# Altium schematic sheet Otto 2.SchDoc
size B
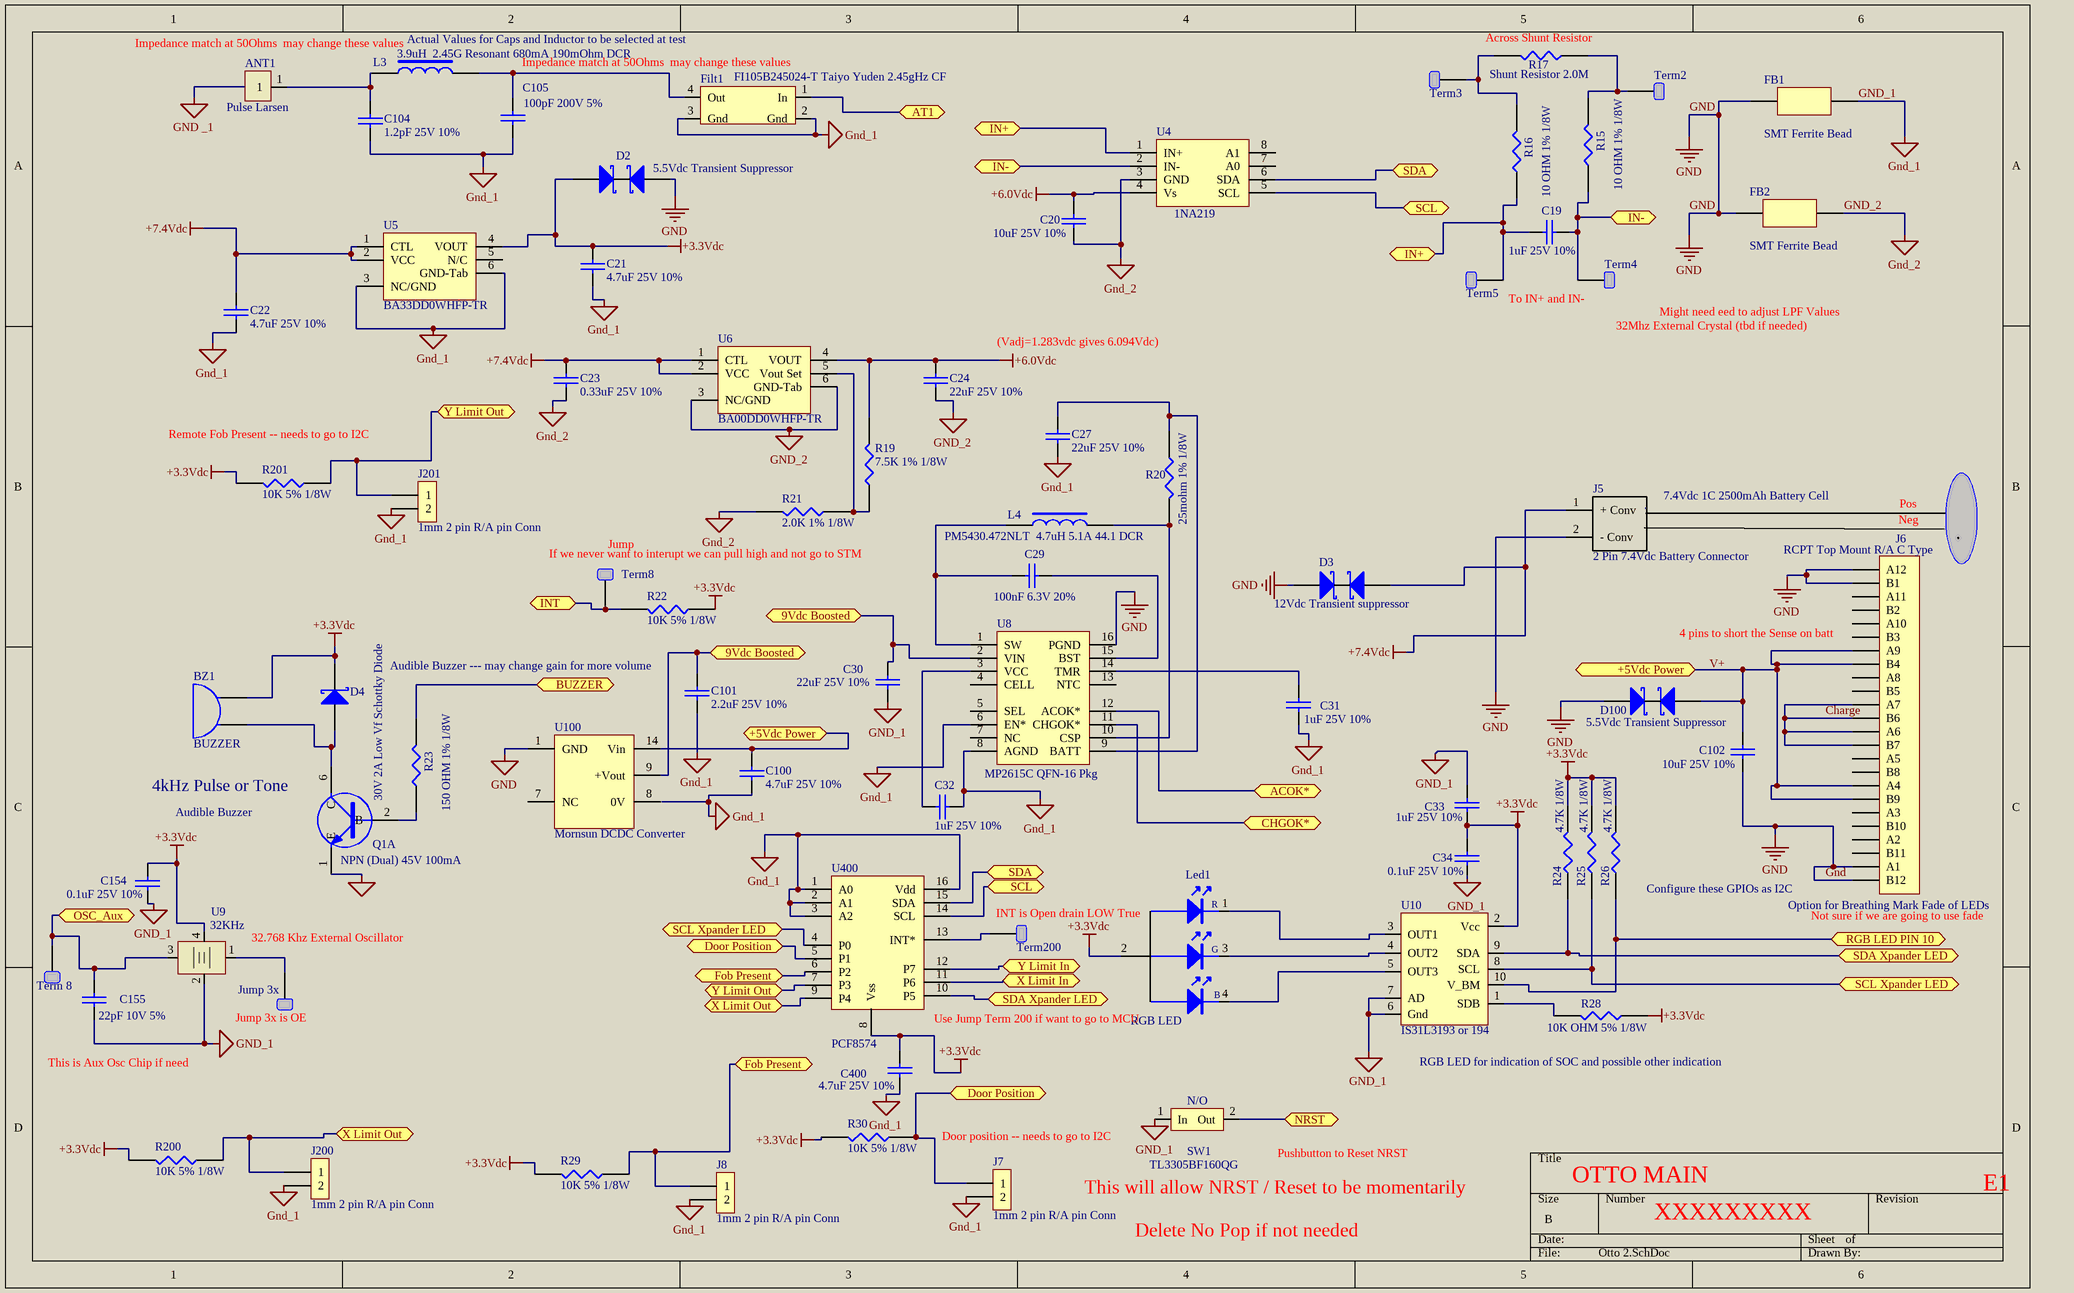
[diagram p0: Otto 2.SchDoc]

## Parts
ANT1  Pulse Larsen  [Pulse Larsen - duplicate]
BZ1  BUZZER  [BUZZER-smd]
C19  1uF 25V 10%  [0603]
C20  10uF 25V 10%  [BEADC3225X280N]
C21  4.7uF 25V 10%  [0603]
C22  4.7uF 25V 10%  [0603]
C23  0.33uF 25V 10%  [0603]
C24  22uF 25V 10%  [C1210]
C27  22uF 25V 10%  [C1210]
C29  100nF 6.3V 20%  [0603]
C30  22uF 25V 10%  [C1210]
C31  1uF 25V 10%  [0603]
C32  1uF 25V 10%  [0603]
C33  1uF 25V 10%  [0603]
C34  0.1uF 25V 10%  [0402]
C100  4.7uF 25V 10%  [0603]
C101  2.2uF 25V 10%  [0603]
C102  10uF 25V 10%  [BEADC3225X280N]
C104  1.2pF 25V 10%  [0402]
C105  100pF 200V 5%  [0603]
C154  0.1uF 25V 10%  [0402]
C155  22pF 10V 5%  [0805]
C400  4.7uF 25V 10%  [0603]
D2  5.5Vdc Transient Suppressor  [TDK-TVS]
D3  12Vdc Transient suppressor  [VS12BA-TVS]
D4  30V 2A Low Vf Schottky Diode  [SOD 123]
D100  5.5Vdc Transient Suppressor  [TDK-TVS]
FB1  Max DCR 0.05ohm  3A  [0805]  (value not drawn)
FB2  Max DCR 0.05ohm  3A  [0805]  (value not drawn)
Filt1  FI105B245024-T Taiyo Yuden 2.45gHz CF  [Filter]
J5  2 Pin 7.4Vdc Battery Connector  [GTK 2 pin Batt  RA]
J6  RCPT Top Mount R/A C Type  [C-Conn]
J7  1mm 2 pin R/A pin Conn  [GTK-2]
J8  1mm 2 pin R/A pin Conn  [GTK-2]
J200  1mm 2 pin R/A pin Conn  [GTK-2]
J201  1mm 2 pin R/A pin Conn  [GTK-2]
Jump_3x  Hook Up Terminal  [Pad]  (value not drawn)
L3  3.9uH  2.45G Resonant 680mA 190mOhm DCR  [0603]
L4  PM5430.472NLT  4.7uH 5.1A 44.1 DCR  [Pulse 3A5430]
Led1  RGB LED  [4P RGB LED]
Q1  NPN (Dual) 45V 100mA  [SOT-363]  (part A of 2)
R15  10 OHM 1% 1/8W  [0805]
R16  10 OHM 1% 1/8W  [0805]
R17  Shunt Resistor 2.0M  [2512]
R19  7.5K 1% 1/8W  [0805]
R20  25mohm 1% 1/8W  [0805]
R21  2.0K 1% 1/8W  [0805]
R22  10K 5% 1/8W  [0805]
R23  150 OHM 1% 1/8W  [0805]
R24  4.7K 1/8W  [0805]
R25  4.7K 1/8W  [0805]
R26  4.7K 1/8W  [0805]
R28  10K OHM 5% 1/8W  [0805]
R29  10K 5% 1/8W  [0805]
R30  10K 5% 1/8W  [0805]
R200  10K 5% 1/8W  [0805]
R201  10K 5% 1/8W  [0805]
SW1  TL3305BF160QG  [Switch]
Term2  Hook Up Terminal  [Pad]  (value not drawn)
Term3  Hook Up Terminal  [Pad]  (value not drawn)
Term4  Hook Up Terminal  [Pad]  (value not drawn)
Term5  Hook Up Terminal  [Pad]  (value not drawn)
Term8  Hook Up Terminal  [Pad]  (value not drawn)
Term200  Hook Up Terminal  [Pad]  (value not drawn)
Term_8  Hook Up Terminal  [Pad]  (value not drawn)
U4  1NA219  [INA219]
U5  BA33DD0WHFP-TR  [HRP-5]
U6  BA00DD0WHFP-TR  [HRP-5]
U8  MP2615C QFN-16 Pkg  [QFN-16]
U9  32KHz  [XTAL AND OSC]
U10  IS31L3193 or 194  [DFN-10]
U100  Mornsun DCDC Converter  [B0509D-2WR3]
U400  PCF8574  [SOIC-16]

## Ports
9Vdc Boosted (bidir), +5Vdc Power (bidir), ACOK* (bidir), AT1 (bidir), BUZZER (bidir), CHGOK* (bidir), Door Position (bidir), Fob Present, Fob Present (bidir), IN+ (bidir), IN- (bidir), INT (bidir), NRST (bidir), OSC_Aux (bidir), RGB LED PIN 10 (bidir), SCL (bidir), SCL Xpander LED (bidir), SDA (bidir), SDA Xpander LED (bidir), X Limit In (bidir), X Limit Out (bidir), Y Limit In (bidir), Y Limit Out (bidir)

## Nets
+3.3Vdc: BZ1.2(B) C21.2 C33.2 C34.1 C154.1 C400.2 D2.1 D4.1 Led1.2 R22.1 R24.2 R25.2 R26.2 R28.2 R29.2 R30.2 R200.2 R201.2 U5.4(VOUT) U9.4 U10.2(Vcc) U400.8(Vss)
+6.0Vdc: C20.1 C24.2 R19.2 U4.4(Vs) U6.4(VOUT)
+7.4Vdc: C22.2 C23.2 D3.2 J5.1(+_Conv) U5.1(CTL) U5.2(VCC) U6.1(CTL) U6.2(VCC)
GND: C102.2 D2.2 D3.1 D100.1 FB1.1 FB2.1 J5.2(-_Conv) J6.A1 J6.A12 J6.B1 J6.B12 U8.16(PGND) U100.1(GND)
GND_1: C21.1 C22.1 C27.1 C30.1 C31.2 C32.2 C33.1 C34.2 C100.1 C101.1 C104.2 C105.2 C154.2 C155.2 C400.1 FB1.2 Filt1.2(Gnd) Filt1.3(Gnd) J7.2 J8.2 J200.2 J201.2 Q1.1(E) SW1.1(In) U5.3(NC/GND) U5.6(GND-Tab) U8.6(EN*) U8.8(AGND) U9.2 U10.6(Gnd) U10.7(AD) U400.1(A0) U400.2(A1) U400.3(A2) U400.16(Vdd)
GND_2: C20.2 C23.1 C24.1 FB2.2 R21.2 U4.3(GND) U6.3(NC/GND) U6.6(GND-Tab)
9Vdc Boosted: C30.2 C101.2 U8.2(VIN) U100.9(+Vout) ; port 9Vdc Boosted
+5Vdc Power: C100.2 C102.1 D100.2 J6.A4 J6.A9 J6.B4 J6.B9 U100.14(Vin) ; port +5Vdc Power
ACOK*: U8.12(ACOK*) ; port ACOK*
AT1: Filt1.1(In) ; port AT1
BUZZER: R23.2 ; port BUZZER
Charge: J6.A6 J6.A7 J6.B6 J6.B7
CHGOK*: U8.11(CHGOK*) ; port CHGOK*
Door Position: J7.1 R30.1 U400.5(P1) ; port Door Position
Fob Present: J8.1 R29.1 U400.6(P2) ; port Fob Present
IN+: C19.1 R16.1 Term5.1 U4.1(IN+) ; port IN+
IN-: C19.2 R15.1 Term4.1 U4.2(IN-) ; port IN-
INT: R22.2 Term8.1 ; port INT
NRST: SW1.2(Out) ; port NRST
OSC_Aux: C155.1 Term_8.1 U9.3 ; port OSC_Aux
RGB LED PIN 10: R26.1 U10.10(V_BM) ; port RGB LED PIN 10
SCL: U4.5(SCL) U400.14(SCL) ; port SCL
SCL Xpander LED: R25.1 U10.8(SCL) U400.4(P0) ; port SCL Xpander LED
SDA: U4.6(SDA) U400.15(SDA) ; port SDA
SDA Xpander LED: R24.1 U10.9(SDA) U400.10(P5) ; port SDA Xpander LED
X Limit In: U400.11(P6) ; port X Limit In
X Limit Out: J200.1 R200.1 U400.9(P4) ; port X Limit Out
Y Limit In: U400.12(P7) ; port Y Limit In
Y Limit Out: J201.1 R201.1 U400.7(P3) ; port Y Limit Out
NetANT1_1: ANT1.1 C104.1 L3.1
NetBZ1_1: BZ1.1(A) D4.2 Q1.6(C)
NetC27_2: C27.2 R20.1 U8.9(BATT)
NetC29_1: C29.1 U8.15(BST)
NetC29_2: C29.2 L4.1 U8.1(SW)
NetC31_1: C31.1 U8.14(TMR)
NetC32_1: C32.1 U8.3(VCC)
NetC105_1: C105.1 Filt1.4(Out) L3.2
NetJump_3x_1: Jump_3x.1 U9.1
NetL4_2: L4.2 R20.2 U8.10(CSP)
NetLed1_1: Led1.1(R) U10.3(OUT1)
NetLed1_3: Led1.3(G) U10.4(OUT2)
NetLed1_4: Led1.4(G) U10.5(OUT3)
NetQ1_2: Q1.2(B) R23.1
NetR15_2: R15.2 R17.1 Term2.1
NetR16_2: R16.2 R17.2 Term3.1
NetR19_1: R19.1 R21.1 U6.5(Vout_Set)
NetR28_1: R28.1 U10.1(SDB)
NetTerm200_1: Term200.1 U400.13(INT*)

Not connected (* = marked no-connect by the designer): J6 A2 A3 A5 A8 A10 A11 B2 B3 B5 B8 B10 B11; U4 7(A0) 8(A1); U5 5(N/C); U8 4(CELL) 5(SEL) 7(NC) 13(NTC); U100 7(NC) 8(0V)

## Notes on the sheet
- Impedance match at 50Ohms  may change these values
- (near L3) Actual Values for Caps and Inductor to be selected at test
- (near R17) Across Shunt Resistor
- (near Term4) To IN+ and IN-
- (Vadj=1.283vdc gives 6.094Vdc)
- (near Term4) 32Mhz External Crystal (tbd if needed)
- Might need eed to adjust LPF Values
- Remote Fob Present -- needs to go to I2C
- 7.4Vdc 1C 2500mAh Battery Cell
- Pos
- (near Term8) If we never want to interupt we can pull high and not go to STM
- (near Term8) Jump
- (near J6) Neg
- (near J6) 4 pins to short the Sense on batt
- (near C101) Audible Buzzer --- may change gain for more volume
- (near Q1) 4kHz Pulse or Tone
- Audible Buzzer
- (near R26) Configure these GPIOs as I2C
- (near J6) Option for Breathing Mark Fade of LEDs
- (near U9) 32.768 Khz External Oscillator
- (near Led1) INT is Open drain LOW True
- (near J6) Not sure if we are going to use fade
- (near Jump_3x) Jump 3x is OE
- Use Jump Term 200 if want to go to MCU
- (near C155) This is Aux Osc Chip if need
- RGB LED for indication of SOC and possible other indication
- (near SW1) Door position -- needs to go to I2C
- Pushbutton to Reset NRST
- This will allow NRST / Reset to be momentarily
- Delete No Pop if not needed
- OTTO MAIN
- XXXXXXXXX
- E1
- Labels drawn without touching a wire or pin: V+
- (in symbol RGB LED) B
- (in symbol SPSP Switch) N/O

## Library data of the parts
ANT1 = ANT: W3230 Pulse Larsen BLE 2.5Ghz 2.57 at Digikey
BZ1 = BUZZER: KLJ-5030 (Keliking) 4kHz Buzzer 71 cents from LcSc.com
C19 C31-C33 = CAP: CC0603KRX5R8BB105 1uf 25V 10% Yageo 3 cents at Mouser
C20 C102 = CAP: CC1210KFX7R8BB106 Yageo 10uF 25V 10% 23 cents at Mouser
C21 C22 C100 C400 = CAP: GRM188R61E475KE11D Murata 4.7uF 25V 10% 7.9 centsat Mouser
C23 = CAP: C1608X7R1E334K080AC 0.33uF 25V 10% 2.8 cents at Mouser
C24 C27 C30 = CAP: TMK325B7226KM8P Taito Uden 22uF 25V X7R 10%    47cents at Mouser
C29 = CAP: 06036C104MAZ2A Kyocera 100nf 6.3V 20% 12 cents at Mouse
C34 C154 = CAP: TMK105BJ104KV8F Taiyo Uden 0.1uF 25V 10% 2.3 cents at Mouser
C101 = CAP: GRM188C71E225KE11J 2.2uF 25V 10% 0.19 usd @digikey
C104 = CAP: VJ0402A1R2BXXCW1BC  Vishay 13 cents at Mouser
C105 = CAP: C0603C101J2GACAUTO Kemet 5% 200V 0603 12 cents at Mouser
C155 = CAP: C0805C220J8GACAUTO Kemet 0805 22pF 5% 7 cents at Mouser
D2 D100 = X1-DFN1006-2: B74111U0055M060  TDK 5.5vdc Supressor 3cents at Mouser
D3 = VS12VBA1HST15R: VS12VBA1HST15R  Rohm 12Vdc Transient Supressor 5cents at Digikey
D4 = DIODE SCHOTTKY: MBR230LSFT1G On Semi 2A 30V Diode SOD 123 23 cents at Newark
FB1 FB2 = FERRITE BEAD: 2508051217Z3 (Fair-Rite) 4.8 cents at Mouser; Text Field1: SMT Ferrite Bead
Filt1 = Filter RF: FI105B245024-T Taiyo Uuden RF 2.45gHz  Filter 4 pin smd 37 cents at Digikey
J5 = 2 PIN .1"  HDR: 640457-2  TE Connectivity 2 pin r-a battery conn 8.6cents at Mouser
J6 = C-Type Conn: USB3CF24M-H05 (HJC Conectors)
J7 J8 J200 J201 = 2 PIN .1mm GTK Receptacle_1: WTBI-02S-CF3-R 5 pin R-A 1mm center GTK Receptacle
L3 = INDUCTOR2: 0603HP-39NXGLU CoilCraft  190mOhm 680mA 2.45Ghz Resonant
L4 = INDUCTOR2: PM5430.472NLT  4.7uH 5.1A 44.1 DCR Ohms 20% 80 Cents at Digikey
Led1 = RGB LED: 521-8559F Dialight $p RGB 5mm Common Anode through hole 26 cents at Mouser
Q1 = SOT-363: BC847BS,115 Nexperia Dual NPN 8.9cents at Mouser
R15 R16 = RES1: CMP0805-FX-10R0ELF Bournes 10 ohm 1% .125 2.4 cents at Mouser
R17 = RES1: PSR100KTQFJ2L00 64cents at Mouser
R19 = RES1: KTR10EZPF7501 Rohm 7,5K 1% 3 cents at Mouser
R20 = RES1: CRF0805-FZ-R025ELF 25mohm 1% Current Shunt Resistor 16 cents at Mouser
R21 = RES1: SDR10EZPF2001 Rohm 2.0k 1% 2.1 cents at Mouser
R22 R29 R30 R200 R201 = RES1: CRCW080510K0JNEAC  5% .125 .8cents at Mouser
R23 = RES1: RC0805FR-07150RL  Yageo 150ohm 1% .125 1.6 cents at Digikey
R24-R26 = RES1: RC0805JR-074K7L Yageo 4.7K .125 10% 11 cents at Mouser
R28 = RES1: R0805JR-0710KL Yageo 10k .125 5% 27 cents at Digikey
SW1 = SPSP Switch: TL3305BF160QG SPST E-Switch Pushbutton Normally Open Tactile 1.5cents at Mouser
U4 = 1NA219: INA219AIDCNR Current Sensor  1.29 sd at mouser
U5 = 3.3 Fixed LDO: BA33DD0WHFP-TR 3.3Vdc LDO Rohm 2.15 usd at mouser
U6 = 6.0 Vdc LDO: BA00DD0WHFP-TR 6.0Vdc LDO Rohm  1.24 usd at mouser
U8 = MP2615C: MP2615C Batt Charger IC usd at mouser
U9 = XTAL: Pericom 3270004 32KhZ
U10 = IS31FL3193 RGB Drive: IS31FL3194-CLS2-TR RGB Driver 62 cents at Mouser also look at IS31FL3193 part
U100 = B0509D- 2WR3: B0509D- 2WR3  DC to DC Boost 5 to 9Vdc 2.80 at Digikey
U400 = PCF8574: PCF8574 I2C Expander  fix   usd at mouser